# Altium project PCB_Project.PrjPcb
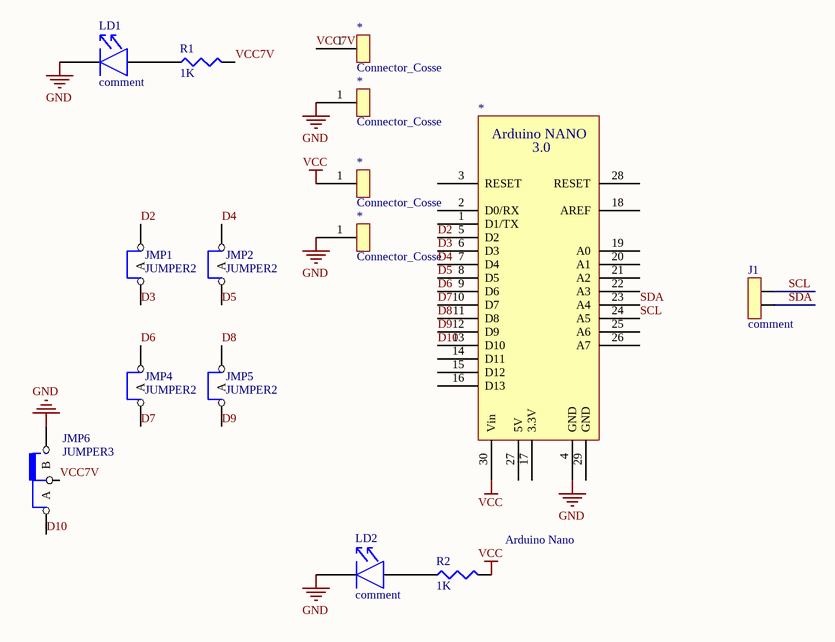
[diagram p0: Shield_nano.SchDoc]
1 sheet, 15 parts. Net scope: global (net labels, ports and power ports of the same name join across sheets).
Board file: Shield_nano.PCBDOC

## Sheet Shield_nano.SchDoc
size A4

### Parts
(Parts that share a designator on the sheet are numbered #1, #2 ... from top to bottom, then left to right.)
*#1  Connector_Cosse  [Connector_Cosse]
*#2  Connector_Cosse  [Connector_Cosse]
*#3  Connector_Cosse  [Connector_Cosse]
*#4  Connector_Cosse  [Connector_Cosse]
*#5  Arduino Nano  [Arduino Nano FootPrint]
J1  comment  [AMP_2]
JMP1  JUMPER2  [JMP2-100]
JMP2  JUMPER2  [JMP2-100]
JMP4  JUMPER2  [JMP2-100]
JMP5  JUMPER2  [JMP2-100]
JMP6  JUMPER3  [JMP3-100]
LD1  comment  [LED0805]
LD2  comment  [LED0805]
R1  value 1K  [0805]  (hidden comment: RES)
R2  value 1K  [0805]  (hidden comment: RES)

### Nets
GND: *#2.1 *#4.1 *#5.4(GND) JMP6.2(B) LD1.K LD2.K
VCC: *#3.1 *#5.30(Vin) R2.2
D2: *#5.5(D2) JMP1.2(com)
D3: *#5.6(D3) JMP1.1(A)
D4: *#5.7(D4) JMP2.2(com)
D5: *#5.8(D5) JMP2.1(A)
D6: *#5.9(D6) JMP4.2(com)
D7: *#5.10(D7) JMP4.1(A)
D8: *#5.11(D8) JMP5.2(com)
D9: *#5.12(D9) JMP5.1(A)
D10: *#5.13(D10) JMP6.1(A)
SCL: *#5.24(A5) J1.1
SDA: *#5.23(A4) J1.2
VCC7V: *#1.1 JMP6.3(com) R1.2
NetLD1_A: LD1.A R1.1
NetLD2_A: LD2.A R2.1

Not connected (* = marked no-connect by the designer): *#5 1(D1/TX) 2(D0/RX) 3(RESET) 14(D11) 15(D12) 16(D13) 17(3.3V) 18(AREF) 19(A0) 20(A1) 21(A2) 22(A3) 25(A6) 26(A7) 27(5V) 28(RESET) 29(GND)

### Notes on the sheet
- (in symbol Arduino Nano) Arduino NANO; 3.0

### Library data of the parts
J1 = POWER2: connecteur alim 2 pôles
JMP1 JMP2 JMP4 JMP5 = JUMPER2: cavalier 1 position
JMP6 = JUMPER3: cavalier 2 positions
LD1 LD2 = LED: LED 5mm/3mm/CMS
R1 R2 = RES: resistance